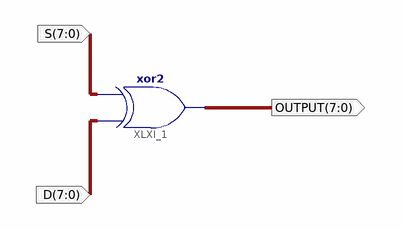
[diagram p0: schematic sheet 1]
// Xilinx ISE schematic XOR.sch (spartan6) as structural Verilog: 1 symbols, 3 ports
module XOR (
  input  [7:0] S,
  input  [7:0] D,
  output [7:0] OUTPUT
);

  assign OUTPUT = D ^ S;  // xor2 XLXI_1, 8 bits wide
endmodule
